# EAGLE design ar_env (EAGLE 7.7.0)
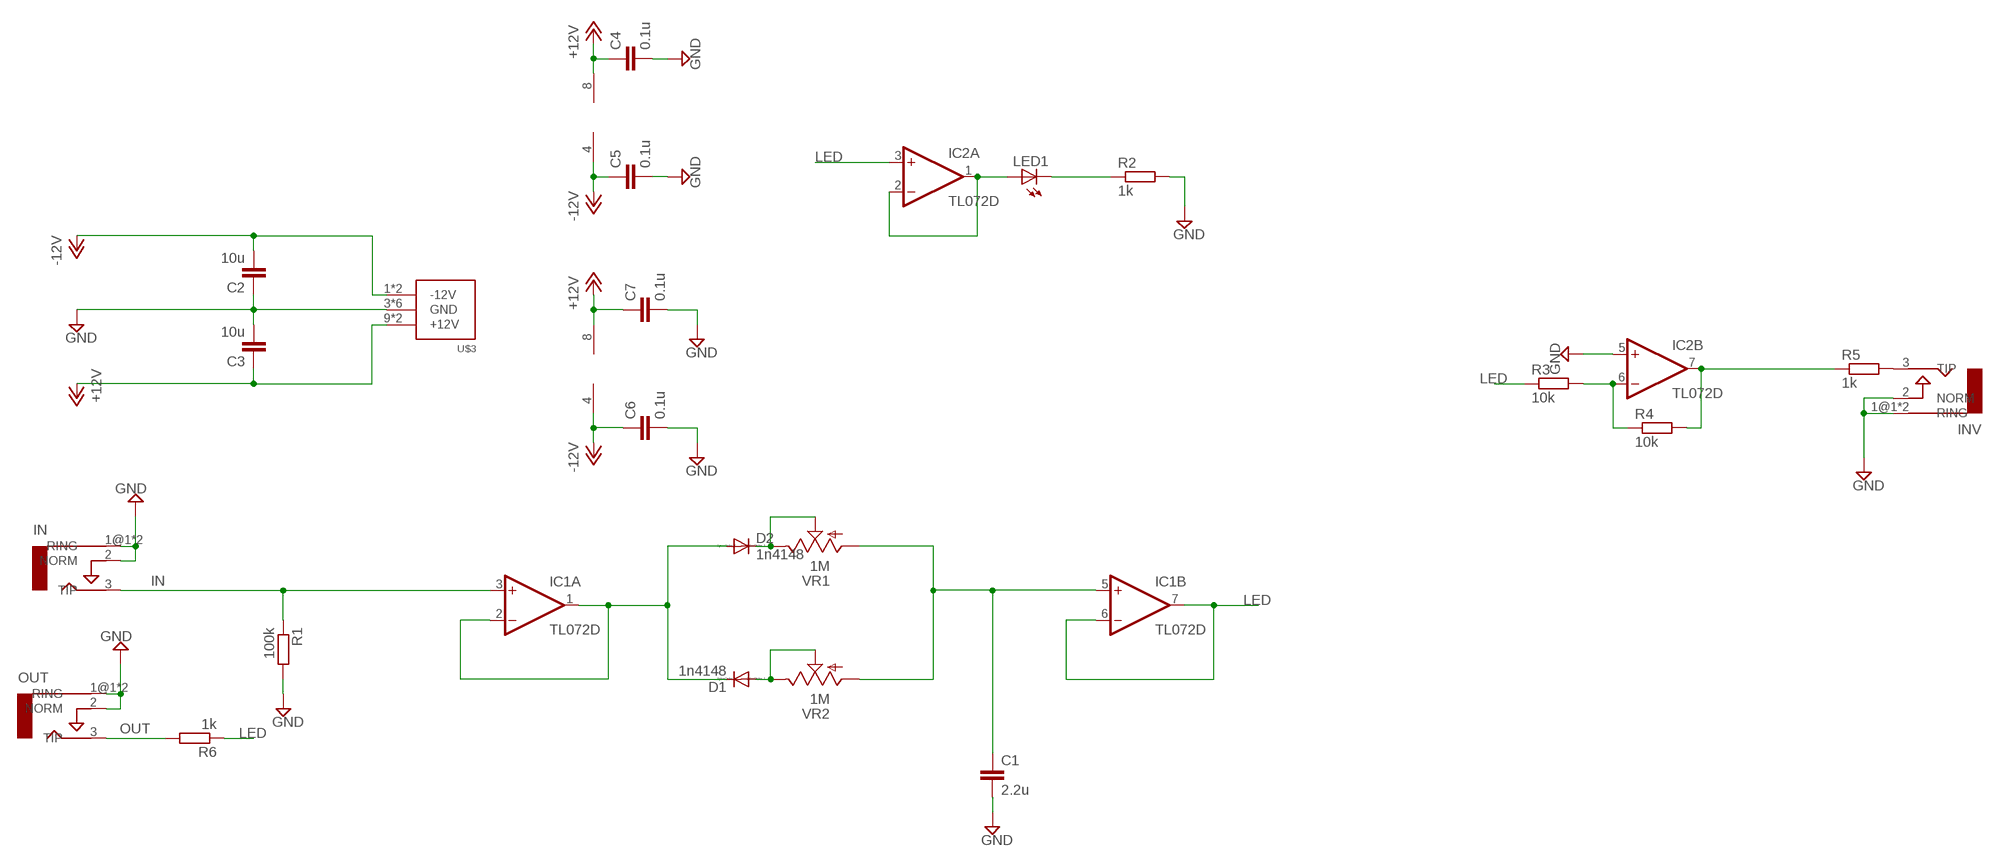
[diagram p0: schematic, sheet 1]

## Parts
C1  2.2u  C-EUC0805  [C0805]
C2  10u  C-EUC0805  [C0805]
C3  10u  C-EUC0805  [C0805]
C4  0.1u  C-EUC0805  [C0805]
C5  0.1u  C-EUC0805  [C0805]
C6  0.1u  C-EUC0805  [C0805]
C7  0.1u  C-EUC0805  [C0805]
D1  1n4148  DIODE-SOD323-W  [SOD323-W]
D2  1n4148  DIODE-SOD323-W  [SOD323-W]
IC1  TL072D  [SO08]
IC2  TL072D  [SO08]
IN  AUDIO-JACKERTHENVAR  [ERTHENVAR-JACK]
INV  AUDIO-JACKERTHENVAR  [ERTHENVAR-JACK]
LED1  LEDCHIP-LED0805  [CHIP-LED0805]
OUT  AUDIO-JACKERTHENVAR  [ERTHENVAR-JACK]
R1  100k  R-EU_R0805  [R0805]
R2  1k  R-EU_R0805  [R0805]
R3  10k  R-EU_R0805  [R0805]
R4  10k  R-EU_R0805  [R0805]
R5  1k  R-EU_R0805  [R0805]
R6  1k  R-EU_R0805  [R0805]
U$3  POWER_SIMPLE10  [POWER_10]
VR1  1M  9MM_SNAP-IN_POT_  [9MM_SNAP-IN_POT]
VR2  1M  9MM_SNAP-IN_POT_  [9MM_SNAP-IN_POT]

## Nets
+12V: C3.1 C4.1 C7.1 IC1.8(P:V+) IC2.8(P:V+) U$3.9(+12V) U$3.10(+12V)
-12V: C2.2 C5.1 C6.1 IC1.4(P:V-) IC2.4(P:V-) U$3.1(-12V) U$3.2(-12V)
GND: C1.2 C2.1 C3.2 C4.2 C5.2 C6.2 C7.2 IC2.5(B:+IN) IN.1@1(RING) IN.1@2(RING) IN.2(NORM) INV.1@1(RING) INV.1@2(RING) INV.2(NORM) OUT.1@1(RING) OUT.1@2(RING) OUT.2(NORM) R1.2 R2.2 U$3.3(GND) U$3.4(GND) U$3.5(GND) U$3.6(GND) U$3.7(GND) U$3.8(GND)
IN: IC1.3(A:+IN) IN.3(TIP) R1.1
LED: IC1.6(B:-IN) IC1.7(B:OUT) IC2.3(A:+IN) R3.1 R6.1
N$1: D2.C VR1.2(S) VR1.3(E)
N$2: D1.A VR2.2(S) VR2.3(E)
N$3: D1.C D2.A IC1.1(A:OUT) IC1.2(A:-IN)
N$4: IC2.1(A:OUT) IC2.2(A:-IN) LED1.A
N$5: C1.1 IC1.5(B:+IN) VR1.1(A) VR2.1(A)
N$6: IC2.7(B:OUT) R4.2 R5.1
N$7: IC2.6(B:-IN) R3.2 R4.1
N$8: LED1.C R2.1
N$10: INV.3(TIP) R5.2
OUT: OUT.3(TIP) R6.2

## Library data of the parts
C1-C7 = rcl:C-EU: CAPACITOR, European symbol
D1 D2 = diode:DIODE-: DIODE
IC1 IC2 = linear:TL072: OP AMP
IN INV OUT = erthenvar:AUDIO-JACK: Switching Mono 3.5mm Audio Jack from Erthenvar.
LED1 = led:LED: LED OSRAM: - CHIPLED LG R971, LG N971, LY N971, LG Q971, LY Q971, LO R971, LY R971 LH N974, LH R974 LS Q976, LO Q976, LY Q976 LO Q996 - Hyper CHIPLED LW Q18S LB Q993, LB Q99A, LB R99A - SideLED LS A670, LO A670, LY A670, LG A670, LP A670 LB A673, LV A673, LT A673, LW A673 LH A674 LY A675 LS A676, LA A676, LO A676, LY A676, LW A676 LS A679, LY A679, LG A679 - Hyper Micro SIDELED® LS Y876, LA Y876, LO Y876, LY Y876 LT Y87S - SmartLED LW L88C, LW L88S LB L89C, LB L89S, LG L890 LS L89K, LO L89K, LY L89K LS L896, LA L896, LO L896, LY L896 - TOPLED LS T670, LO T670, LY T670, LG T670, LP T670 LSG T670, LSP T670, LSY T670, LOP T670, LYG T670 LG T671, LOG T671, LSG T671 LB T673, LV T673, LT T673, LW T673 LH T674 LS T676, LA T676, LO T676, LY T676, LB T676, LH T676, LSB T676, LW T676 LB T67C, LV T67C, LT T67C, LS T67K, LO T67K, LY T67K, LW E67C LS E67B, LA E67B, LO E67B, LY E67B, LB E67C, LV E67C, LT E67C LW T67C LS T679, LY T679, LG T679 LS T770, LO T770, LY T770, LG T770, LP T770 LB T773, LV T773, LT T773, LW T773 LH T774 LS E675, LA E675, LY E675, LS T675 LS T776, LA T776, LO T776, LY T776, LB T776 LHGB T686 LT T68C, LB T68C - Hyper Mini TOPLED® LB M676 - Mini TOPLED Santana® LG M470 LS M47K, LO M47K, LY M47K Source: http://www.osram.convergy.de LUXEON: - LUMILED® LXK2-PW12-R00, LXK2-PW12-S00, LXK2-PW14-U00, LXK2-PW14-V00 LXK2-PM12-R00, LXK2-PM12-S00, LXK2-PM14-U00 LXK2-PE12-Q00, LXK2-PE12-R00, LXK2-PE12-S00, LXK2-PE14-T00, LXK2-PE14-U00 LXK2-PB12-K00, LXK2-PB12-L00, LXK2-PB12-M00, LXK2-PB14-N00, LXK2-PB14-P00, LXK2-PB14-Q00 LXK2-PR12-L00, LXK2-PR12-M00, LXK2-PR14-Q00, LXK2-PR14-R00 LXK2-PD12-Q00, LXK2-PD12-R00, LXK2-PD12-S00 LXK2-PH12-R00, LXK2-PH12-S00 LXK2-PL12-P00, LXK2-PL12-Q00, LXK2-PL12-R00 Source: www.luxeon.com KINGBRIGHT: KA-3528ASYC Source: www.kingbright.com
R1-R6 = rcl:R-EU_: RESISTOR, European symbol
U$3 = eurorack:POWER_SIMPLE
VR1 VR2 = MusicThingModular:9MM_SNAP-IN_POT: 9mm vertical snap-in pot, Alpha / Panasonic style

## Board
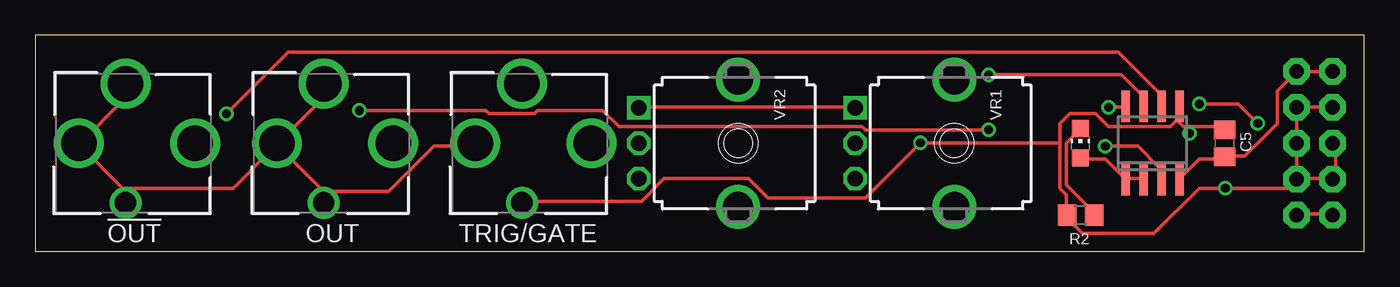
[diagram p1: board, top side]
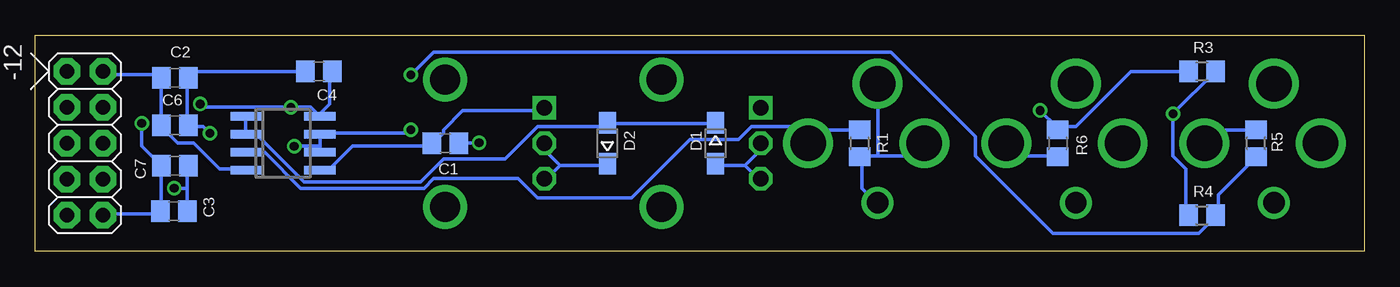
[diagram p2: board, bottom side, seen from below]

Size 93.65 x 15.23 mm. Coordinates in mm from the lower left corner, seen from the top.
Outline: 0,0 93.65,0 93.65,15.23 0,15.23 0,0
Copper layers (1*16): Top 0.035mm / dielectric 1.5mm / Bottom 0.035mm
Design rules "default": minimum track width 10mil, minimum drill 24mil, track to track 8mil, track to pad 8mil, pad to pad 8mil, via to via 8mil, smd to smd 8mil, copper to edge 40mil, drill to drill 8mil, minimum pad ring 10mil, minimum via ring 8mil, stop-mask expansion 4mil, vias tented up to drill 0mil, thermal gap 10mil

### Footprints (pad centres in the part's own frame; a part is rotated, then mirrored left to right if it is on the bottom)
C0805 = smd 1.3 x 1.5: 1 -0.95,0; 2 0.95,0
SOD323-W = smd 1.5 x 1.2: A 1.45,0; C -1.45,0
SO08 = smd 0.6 x 2.2: 1 -1.905,-2.6; 2 -0.635,-2.6; 3 0.635,-2.6; 4 1.905,-2.6; 5 1.905,2.6; 6 0.635,2.6; 7 -0.635,2.6; 8 -1.905,2.6
ERTHENVAR-JACK = drill 2.5: 1@1 -4.2,0; 2 0,-3.3; 3 0,4.9 | drill 1.5: 1@2 4.2,0
CHIP-LED0805 = smd 1.2 x 1.2: A 0,-1.05; C 0,1.05
R0805 = smd 1.3 x 1.5: 1 -0.95,0; 2 0.95,0
POWER_10 = drill 1.016 pad 1.88 octagon: 1 -5.08,-1.27; 2 -5.08,1.27; 3 -2.54,-1.27; 4 -2.54,1.27; 5 0,-1.27; 6 0,1.27; 7 2.54,-1.27; 8 2.54,1.27; 9 5.08,-1.27; 10 5.08,1.27
9MM_SNAP-IN_POT = drill 1.1 square: 1 -2.5,-7 | drill 1.1 octagon: 2 0,-7; 3 2.5,-7 | drill 2.1 pad 2.794: CHASSIS1 -4.5,0; CHASSIS2 4.5,0

### Placement (x,y rotation side)
C1  64.77,7.62 0 bottom
C2  83.82,12.23 180 bottom
C3  83.89,2.83 0 bottom
C4  73.66,12.7 180 bottom
C5  83.82,7.62 90 top
C6  83.82,8.89 0 bottom
C7  83.81,6.04 0 bottom
D1  45.72,7.62 270 bottom
D2  53.34,7.62 90 bottom
IC1  76.2,7.62 270 bottom
IC2  78.74,7.62 0 top
IN  34.29,7.62 270 top
INV  6.35,7.62 270 top
LED1  73.66,7.62 0 top
OUT  20.32,7.62 270 top
R1  35.56,7.62 270 bottom
R2  73.66,2.54 180 top
R3  11.43,12.7 0 bottom
R4  11.43,2.54 0 bottom
R5  7.62,7.62 90 bottom
R6  21.59,7.62 270 bottom
U$3  90.17,7.62 270 bottom
VR1  64.77,7.62 270 top
VR2  49.53,7.62 270 top

### Tracks (layer width: path | path; a pad name or v marks a point on that pad's centre or on a via)
+12V  (via drill 0.61)
  Top 0.254: v75.64,10.16 76.78,10.16 IC2.8 | U$3.9 91.41,2.62 88.9,2.62 U$3.10 | v82.04,10.39 84.78,10.39 v86.16,9.02
  Bottom 0.254: C4.1 72.9,12.68 72.9,10.39 73.58,9.7 IC1.8 73.81,9.7 74.27,10.16 v75.64,10.16 81.81,10.16 v82.04,10.39 | U$3.10 88.9,2.62 85.01,2.62 C3.1 84.78,2.85 84.78,5.82 C7.1 84.78,6.04 86.16,7.42 v86.16,9.02
-12V
  Top 0.254: IC2.4 80.67,5.13 82.04,6.5 83.64,6.5 C5.1 83.87,6.73 85.24,6.73 87.53,9.02 87.53,11.3 88.9,12.68 | 88.9,12.68 91.41,12.68 U$3.1 | 88.9,12.68 U$3.2
  Bottom 0.254: IC1.4 78.84,5.82 80.67,5.82 82.5,7.64 83.64,7.64 84.78,8.79 C6.1 84.78,9.02 84.78,12.22 C2.2 84.78,12.45 88.67,12.45 88.9,12.68 U$3.2
GND  (via drill 0.61)
  Top 0.254: U$3.3 U$3.4 U$3.6 88.9,5.13 | U$3.5 91.64,7.42 91.64,5.13 U$3.7 91.41,5.13 88.9,5.13 | 88.9,5.13 U$3.8 88.9,4.9 88.44,4.45 v83.87,4.45 82.04,4.45 78.84,1.25 73.81,1.25 72.67,2.39 R2.2 72.67,2.62 72.67,3.99 72.21,4.45 72.21,7.64 | 72.21,7.64 72.21,9.02 72.9,9.7 74.73,9.7 75.64,8.79 79.98,8.79 80.44,9.25 | 80.44,9.25 80.44,10.16 IC2.5 80.44,9.25 | 72.21,7.64 v62.38,7.64 58.5,3.76 51.64,3.76 50.27,5.13 44.32,5.13 42.72,3.53 34.49,3.53 IN.1@2 | 81.36,8.79 80.9,8.79 80.44,9.25 | 81.36,8.79 83.64,8.79 C5.2 | 81.36,8.79 v81.36,8.33 | 6.15,4.45 6.15,3.53 INV.1@2 6.15,4.45 | 6.15,4.45 3.17,7.42 INV.2 3.17,7.64 6.15,10.62 6.15,11.76 INV.1@1 | 20.32,4.22 17.12,7.42 OUT.2 | OUT.1@1 20.32,10.85 17.12,7.64 OUT.2 | 6.15,4.45 13.92,4.45 16.89,7.42 OUT.2 | 20.32,4.22 24.89,4.22 28.09,7.42 30.84,7.42 IN.2 | 20.32,4.22 OUT.1@2
  Bottom 0.254: 82.96,4.45 82.96,2.85 C3.2 | 82.96,4.45 82.96,5.82 C7.2 | v83.87,4.45 82.96,4.45 | C4.2 74.73,12.68 82.5,12.68 82.73,12.45 C2.1 82.96,12.22 82.96,9.02 C6.2 82.73,8.79 81.81,8.79 v81.36,8.33 | v62.38,7.64 63.75,7.64 C1.2 | IN.1@2 34.49,3.53 35.41,4.45 35.41,6.5 R1.2 35.41,6.73 34.27,6.73 | 34.27,6.73 31.75,6.73 31.06,7.42 IN.2 | 34.27,6.73 34.27,11.76 IN.1@1
IN
  Bottom 0.254: R1.1 35.64,8.56 38.15,8.56 39.06,7.64 IN.3 39.29,7.64 40.44,8.79 43.18,8.79 44.09,7.87 47.52,7.87 51.64,3.76 58.27,3.76 59.64,5.13 65.58,5.13 66.27,4.45 74.95,4.45 77.47,6.96 78.61,6.96 IC1.3
LED  (via drill 0.61)
  Top 0.254: v75.41,7.42 77.7,7.42 79.3,5.82 79.3,5.13 IC2.3 | v67.18,8.56 58.5,8.56 58.27,8.79 41.12,8.79 39.98,9.93 35.41,9.93 35.18,9.7 31.98,9.7 31.75,9.93 v22.84,9.93
  Bottom 0.254: 73.58,7.42 73.58,8.1 IC1.7 73.58,8.33 67.41,8.33 v67.18,8.56 | 73.58,7.42 73.58,7.19 IC1.6 | 73.58,7.42 v75.41,7.42 | R3.1 12.55,12.68 16.43,12.68 20.32,8.79 21.46,8.79 R6.1 21.69,8.79 v22.84,9.93
N$1
  Bottom 0.254: 56.67,6.04 53.47,6.04 D2.C | 56.67,6.04 57.58,5.13 VR1.3 | 56.67,6.04 57.58,6.96 57.58,7.42 VR1.2
N$2
  Bottom 0.254: 43.64,6.04 45.7,6.04 D1.A | 43.64,6.04 42.72,5.13 VR2.3 | 43.64,6.04 42.72,6.96 42.72,7.42 VR2.2
N$3
  Bottom 0.254: IC1.1 78.84,9.47 78.84,8.33 IC1.2 78.61,8.1 77.93,8.1 74.73,4.9 66.5,4.9 64.9,6.5 60.55,6.5 58.27,8.79 53.7,8.79 53.47,9.02 D2.A 53.24,9.02 45.92,9.02 D1.C
N$4
  Top 0.254: LED1.A 73.81,6.5 75.41,6.5 76.78,5.13 IC2.1 77.01,5.13 77.93,5.13 IC2.2
N$5
  Top 0.254: VR2.1 42.72,10.16 57.58,10.16 VR1.1
  Bottom 0.254: IC1.5 73.58,5.82 72.9,5.82 71.3,7.42 65.81,7.42 C1.1 65.58,7.64 64.9,8.33 64.9,8.56 63.52,9.93 57.81,9.93 VR1.1
N$6  (via drill 0.61)
  Top 0.254: v67.18,12.45 76.56,12.45 77.93,11.07 77.93,10.39 IC2.7
  Bottom 0.254: R5.1 7.75,6.5 10.26,3.99 10.26,2.62 R4.2 10.49,2.39 11.63,1.25 21.92,1.25 27.41,6.73 27.41,8.1 33.35,14.05 65.58,14.05 v67.18,12.45
N$7  (via drill 0.61)
  Top 0.254: v13.46,9.7 17.8,14.05 76.33,14.05 79.3,11.07 79.3,10.39 IC2.6
  Bottom 0.254: R4.1 12.55,2.62 12.55,5.82 13.46,6.73 v13.46,9.7 10.49,12.68 R3.2
N$8
  Top 0.254: LED1.C 73.58,8.56 72.67,7.64 72.67,4.67 74.73,2.62 R2.1
N$10
  Bottom 0.254: R5.2 7.75,8.56 10.26,8.56 11.18,7.64 INV.3
OUT
  Bottom 0.254: R6.2 21.69,6.73 24.44,6.73 25.12,7.42 OUT.3

### Text on the board
tNames: !OUT | OUT | TRIG/GATE